# EasyEDA Pro project ProDocument_Board1_2024-07-10.epro

# Schematic 单相电能计量
Create Date: 2024-05-12; Page Name: P1; Project Name: 电赛校赛; Schematic Name: Schematic1; Update Date: 2024-07-09; Company: 无线电爱好者协会; Drawed: wuneng; Page Size: A4; Version: V1.0
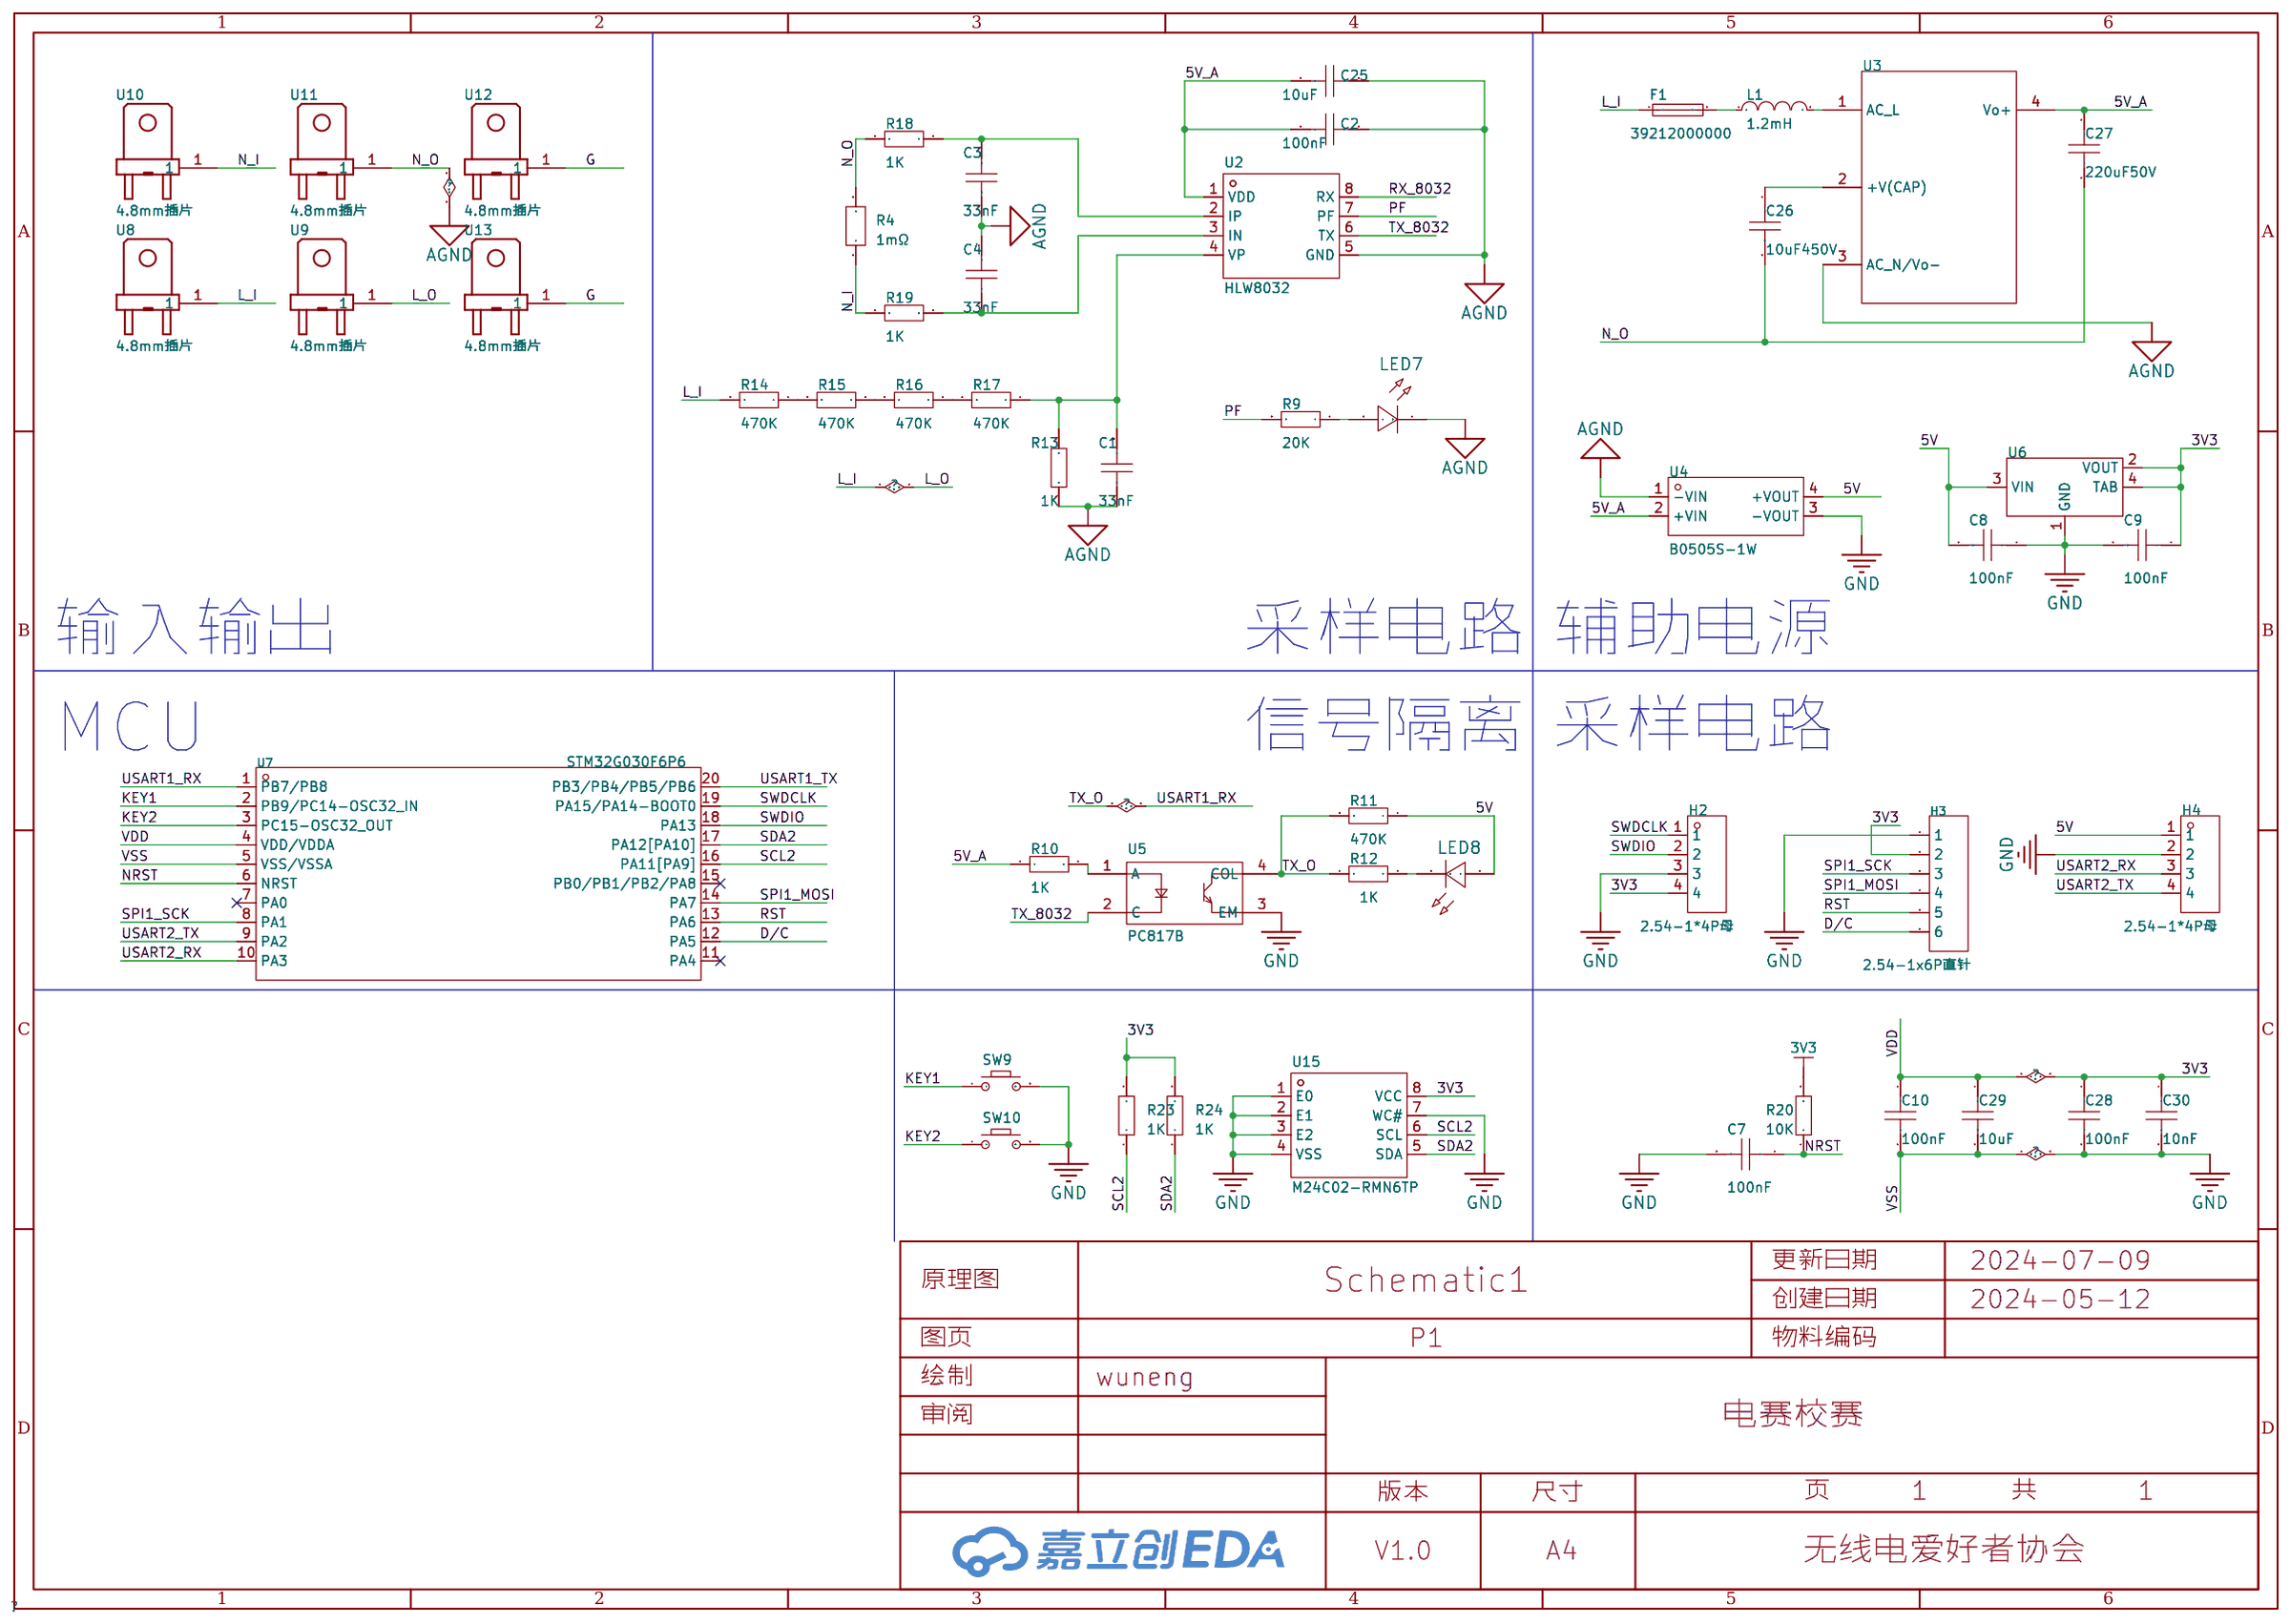
[diagram p0: schematic sheet]

## Parts
C1  33nF  [C0805]
C2  100nF  [C0805]
C3  33nF  [C0805]
C4  33nF  [C0805]
C7  100nF  [C0805]
C8  100nF  [C0805]
C9  100nF  [C0805]
C10  100nF  [C0805]
C25  10uF  [C0805]
C26  10uF450V  [CAP-TH_BD13.5-P5.00-D0.8-FD]
C27  220uF50V  [CAP-TH_BD10.0-F5.00-D0.6-FD]
C28  100nF  [C0805]
C29  10uF  [C0805]
C30  10nF  [C0805]
F1  39212000000  [FUSE-TH_L8.5-W4.0-P5.08-D0.6]
H2  2.54-1*4P母  [HDR-TH_4P-P2.54-V-F]
H3  2.54-1x6P直针  [HDR-TH_6P-P2.54-V-M-1]
H4  2.54-1*4P母  [HDR-TH_4P-P2.54-V-F]
L1  1.2mH  [IND-SMD_L5.8-W5.2]
LED7  -  [LED_0603]
LED8  -  [LED_0603]
R4  1mΩ  [RES-SMD_L6.4-W3.2-R2512]
R9  20K  [R0603]
R10  1K  [R0805]
R11  470K  [R0805]
R12  1K  [R0805]
R13  1K  [R0805]
R14  470K  [R0805]
R15  470K  [R0805]
R16  470K  [R0805]
R17  470K  [R0805]
R18  1K  [R0805]
R19  1K  [R0805]
R20  10K  [R0805]
R23  1K  [R0805]
R24  1K  [R0805]
SW9  -  [Key_TH_3.5x6x4.3]
SW10  -  [Key_TH_3.5x6x4.3]
U2  HLW8032  [SOP-8_L4.9-W3.9-P1.27-LS6.0-BL]
U3  -  [LS01-K3B05SS]
U4  B0505S-1W  [PWRM-TH_B0505S-1W]
U5  PC817B  [OPTO-SMD-4_L4.6-W6.5-P2.54-LS10.3-TL]
U6  -  [SOT_223]
U7  STM32G030F6P6  [TSSOP-20_L6.5-W4.4-P0.65-LS6.4-BL]
U8  4.8*0.8MM  [footprint_927b]
U9  4.8*0.8MM  [footprint_927b]
U10  4.8*0.8MM  [footprint_927b]
U11  4.8*0.8MM  [footprint_927b]
U12  4.8*0.8MM  [footprint_927b]
U13  4.8*0.8MM  [footprint_927b]
U15  M24C02-RMN6TP  [SOIC-8_L4.9-W3.9-P1.27-LS6.0-BL]

## Library data of the parts
C1-C4 C7-C10 C25 C28-C30 = CAP_0805: Supplier Footprint: 0805
C26 C27 = CAP_0603: Supplier Footprint: 0603
F1 = 39212000000: 类型:-;额定电流:2A;分断能力:25A;; LCSC Part Name: 插件式保险丝; Supplier Part: C142678; Manufacturer: Littelfuse(美国力特); Supplier Footprint: 插件; JLCPCB Part Class: Extended Part; Datasheet: https://atta.szlcsc.com/upload/public/pdf/source/20180403/C178817_2D458C2629887F55DF1F1D88ABF4A67F.pdf; Supplier: LCSC; Current Rating: 2A; Operating Temperature: -40℃~+125℃; Breaking Capacity: 25A
H2 H4 = 2.54-1*4P母: 插孔结构:1x4P;间距:2.54mm;行距:-;圆孔/方孔:方孔;安装类型:直插;排数:单排;总孔位数:4P;额定电流:3A;额定电压:-;插孔方向:顶部;塑高:-;触头材质:青铜;触头镀层:-;工作温度范围:-40℃~+105℃;焊接温度(最大值):-;; LCSC Part Name: 间距:2.54mm 1x4P 直插; Supplier Part: C2718488; Manufacturer: BOOMELE(博穆精密); Supplier Footprint: 插件,P=2.54mm; JLCPCB Part Class: Extended Part; Datasheet: https://atta.szlcsc.com/upload/public/pdf/source/20210301/C2718488_F4427B881E42CAA8DDB0B1C12B3A522C.pdf; Supplier: LCSC; Holes Structure: 1x4P; Pitch: 2.54mm; Circular Hole / Square Hole: 方孔; Mounting Type: 直插; Number of Rows: 单排; Number of Holes: 4P; Current Rating (Max): 3A; Holes Direction: 顶部; Contact Material: 青铜; Operating Temperature Range: -40℃~+105℃
H3 = 2.54-1x6P直针: 插针结构:1x6P;间距:2.54mm;行距:-;圆针/方针:方针;安装类型:直插;排数:单排;总PIN位数:6P;额定电流:3A;额定电压:-;配合针长度:-;塑高:-;触头材质:黄铜;触头镀层:-;工作温度范围:-40℃~+105℃;颜色:黑色;; LCSC Part Name: 间距:2.54mm 1x6P 直插 方针; Supplier Part: C37208; Manufacturer: BOOMELE(博穆精密); Supplier Footprint: 插件,P=2.54mm; JLCPCB Part Class: Extended Part; Supplier: LCSC; Pin Structure: 1x6P; Pitch: 2.54mm; Circluar Pins/Square Pins: 方针; Mounting Type: 直插; Number of Rows: 单排; Number of Pins: 6P; Current Rating (Max): 3A; Contact Material: 黄铜; Operating Temperature Range: -40℃~+105℃; Color: 黑色
L1 = CD54-1R0M: 电感值:1uH;精度:±20%;额定电流:5.9A;; LCSC Part Name: 1uH ±20%; Supplier Part: C501729; Manufacturer: Me-TECH(美台高科); Supplier Footprint: SMD; JLCPCB Part Class: Extended Part; Datasheet: https://atta.szlcsc.com/upload/public/pdf/source/20200324/C501728_0ED92A661C9AA91DB0CB8AF3A2A8117A.pdf; Supplier: LCSC; Tolerance: ±20%; Rated Current: 5.9A; DC Resistance (DCR): 15mΩ
LED7 LED8 = LED_0603-R: Supplier Footprint: 0603
R4 = HoJLR2512-3W-1mR-1%: 电阻类型:采样电阻;阻值:1mΩ;精度:±1%;功率:3W;安装方式:贴片;; LCSC Part Name: 1mΩ ±1% 3W; Supplier Part: C2903470; Manufacturer: Milliohm(毫欧); Supplier Footprint: 2512; JLCPCB Part Class: Extended Part; Datasheet: https://atta.szlcsc.com/upload/public/pdf/source/20211009/7525CABAB363C979E942C1DD41F1FEF0.pdf; Supplier: LCSC; Type: 采样电阻; Tolerance: ±1%; Power(Watts): 3W; Mounting Sytle: 贴片
R9 = Res_0603: Supplier Footprint: 0603
R10-R20 R23 R24 = Res_0805: Supplier Footprint: 0805
SW9 SW10 = Key_TH_3.5x6x4.3: Supplier Footprint: 插件
U2 = HLW8032: HLW8012的升级版串口输出所有数据; Supplier Part: C128023; Manufacturer: 合力为; Supplier Footprint: SOP-8; JLCPCB Part Class: Extended Part; Datasheet: https://atta.szlcsc.com/upload/public/pdf/source/20230727/AC46BB344F63DE89EDC3EE31E404726D.pdf; Supplier: LCSC
U3 = LS01-K3B05SS
U4 = B0505S-1W_C7465127: 转换类型:DC-DC;输入电压(DC):4.5V~5.5V;输出电压:5V;输出功率:1W;输出电流(最大值):200mA;转换效率:80%;; LCSC Part Name: DC-DC输入5V输出5V200mA 1W; Supplier Part: C7465127; Manufacturer: EVISUN(易成); Supplier Footprint: SIP-4; JLCPCB Part Class: Extended Part; Datasheet: https://atta.szlcsc.com/upload/public/pdf/source/20230718/F78F189F7326C257ACEB9375A76D3582.pdf; Supplier: LCSC; Conversion Type: DC-DC; Input Voltage(DC): 4.5V~5.5V; Output Voltage: 5V; Output Power: 1W; Output Current (Max): 200mA; Isolation or not: 隔离; Output Channel: 1; Insulated Voltage: 1.5kV; Conversion Efficiency: 80%; Maximum Capacitive Load: 100uF
U5 = PC817B_C3025163: 输入电压类型:DC;正向电压:1.2V;输出电流:50mA;隔离电压(rms):5kV;反向电压:6V;接收端电压:35V;输出通道数:1;集射极饱和电压(Vce(sat)@Ic,IF):100mV@1mA,20mA;; LCSC Part Name: B档; Supplier Part: C3025163; Manufacturer: GOODWORK(固得沃克); Supplier Footprint: SMD-4P; JLCPCB Part Class: Extended Part; Datasheet: https://atta.szlcsc.com/upload/public/pdf/source/20220530/3FD5D572B823BA05C967330A07ECF74F.pdf; Supplier: LCSC; Input voltage type: DC; Output Type: 光电三极管; Forward Voltage: 1.2V; Output Current: 50mA; Isolation Voltage(rms): 5kV; Reverse Voltage: 6V; Receiving End Voltage: 35V; Number of Outputs: 1; Collector-Emitter Saturation Voltage (Vce(sat)@Ic,IF): 100mV@1mA,20mA; Rise time: 6us@2mA,100Ω; Fall time: 5us@2mA,100Ω; Operating Temperature: -55℃~+110℃
U6 = AMS1117
U7 = STM32G030F6P6: CPU内核:ARM Cortex-M0;CPU最大主频:64MHz;工作电压范围:2V~3.6V;程序存储容量:32KB;程序存储器类型:FLASH;RAM总容量:8KB;GPIO端口数量:18;; Supplier Part: C724040; Manufacturer: ST(意法半导体); Supplier Footprint: TSSOP-20; JLCPCB Part Class: Extended Part; Datasheet: https://atta.szlcsc.com/upload/public/pdf/source/20200511/C529329_A1CB615556C746C4EA827FCAD1461480.pdf; Supplier: LCSC; CPU Core: ARM Cortex-M0; Program Storage Size: 32KB; RAM Size: 8KB; GPIO Ports Number: 18; Operating Voltage Range: 2V~3.6V; CPU Maximum Speed: 64MHz; Program Memory Type: FLASH; Operating Temperature Range: -40℃~+85℃; ADC (Bit): 12bit; Peripheral/Function: DMA；看门狗；看门狗; Internal Oscillator: 有
U8-U13 = 插片*定位*环保  4.8*0.8MM: Part Code: CP0000000005
U15 = M24C02-RMN6TP: 接口类型:I2C;存储容量:2Kbit;; Supplier Part: C83836; Manufacturer: ST(意法半导体); Supplier Footprint: SOIC-8; JLCPCB Part Class: Extended Part; Datasheet: https://atta.szlcsc.com/upload/public/pdf/source/20170713/C118273_1499918870536816701.pdf; Supplier: LCSC; Interface Type: I2C; Memory Size: 2Kbit; Supply Voltage: 1.8V~5.5V; Operating Temperature: -40℃~+85℃

## Nets
3V3: C9.1 C10.1 C28.1 C29.1 C30.1 H2.4 H3.2 R20.2 R23.2 R24.2 U6.2(VOUT) U6.4(TAB) U7.4(VDD/VDDA) U15.8(VCC)
5V: C8.2 H4.1 LED8.2(A) R11.1 U4.4(+VOUT) U6.3(VIN)
5V_A: C2.2 C25.2 C27.1 R10.1 U2.1(VDD) U3.4(Vo+) U4.2(+VIN)
AGND: C1.1 C2.1 C3.1 C4.2 C25.1 C26.2 C27.2 LED7.1(C) R4.2 R13.1 R18.1 U2.5(GND) U3.3(AC_N/Vo-) U4.1(-VIN) U11.1
GND: C7.2 C8.1 C9.2 C10.2 C28.2 C29.2 C30.2 H2.3 H3.1 H4.2 SW9.B SW10.B U4.3(-VOUT) U5.3(EM) U6.1(GND) U7.5(VSS/VSSA) U15.1(E0) U15.2(E1) U15.3(E2) U15.4(VSS) U15.7(WC#)
D/C: H3.6 U7.12(PA5)
G: U12.1 U13.1
KEY1: SW9.A U7.2(PB9/PC14-OSC32_IN)
KEY2: SW10.A U7.3(PC15-OSC32_OUT)
L_I: F1.1 R14.2 U8.1 U9.1
N_I: R4.1 R19.1 U10.1
NRST: C7.1 R20.1 U7.6(NRST)
PF: R9.2 U2.7(PF)
RST: H3.5 U7.13(PA6)
RX_8032: U2.8(RX)
SCL2: R23.1 U7.16(PA11[PA9]) U15.6(SCL)
SDA2: R24.1 U7.17(PA12[PA10]) U15.5(SDA)
SPI1_MOSI: H3.4 U7.14(PA7)
SPI1_SCK: H3.3 U7.8(PA1)
SWDCLK: H2.1 U7.19(PA15/PA14-BOOT0)
SWDIO: H2.2 U7.18(PA13)
TX_8032: U2.6(TX) U5.2(C)
TX_O: R11.2 R12.1 U5.4(COL) U7.1(PB7/PB8)
USART1_TX: U7.20(PB3/PB4/PB5/PB6)
USART2_RX: H4.3 U7.10(PA3)
USART2_TX: H4.4 U7.9(PA2)
$1N1407: R10.2 U5.1(A)
$1N1931: R14.1 R15.2
$1N1957: R15.1 R16.2
$1N1983: R16.1 R17.2
$1N2054: C1.2 R13.2 R17.1 U2.4(VP)
$1N2295: C4.1 R19.2 U2.3(IN)
$1N2301: C3.2 R18.2 U2.2(IP)
$1N3303: LED7.2(A) R9.1
$1N4096: C26.1 U3.2(+V(CAP))
$1N4245: L1.2 U3.1(AC_L)
$1N4248: F1.2 L1.1
$1N6696: LED8.1(C) R12.2

Not connected (* = marked no-connect by the designer): U7 7(PA0)* 11(PA4)* 15(PB0/PB1/PB2/PA8)*

## Notes on the sheet
- 输入输出
- 采样电路
- 辅助电源
- MCU
- 信号隔离
- 采样电路

# Board 单项电能计量
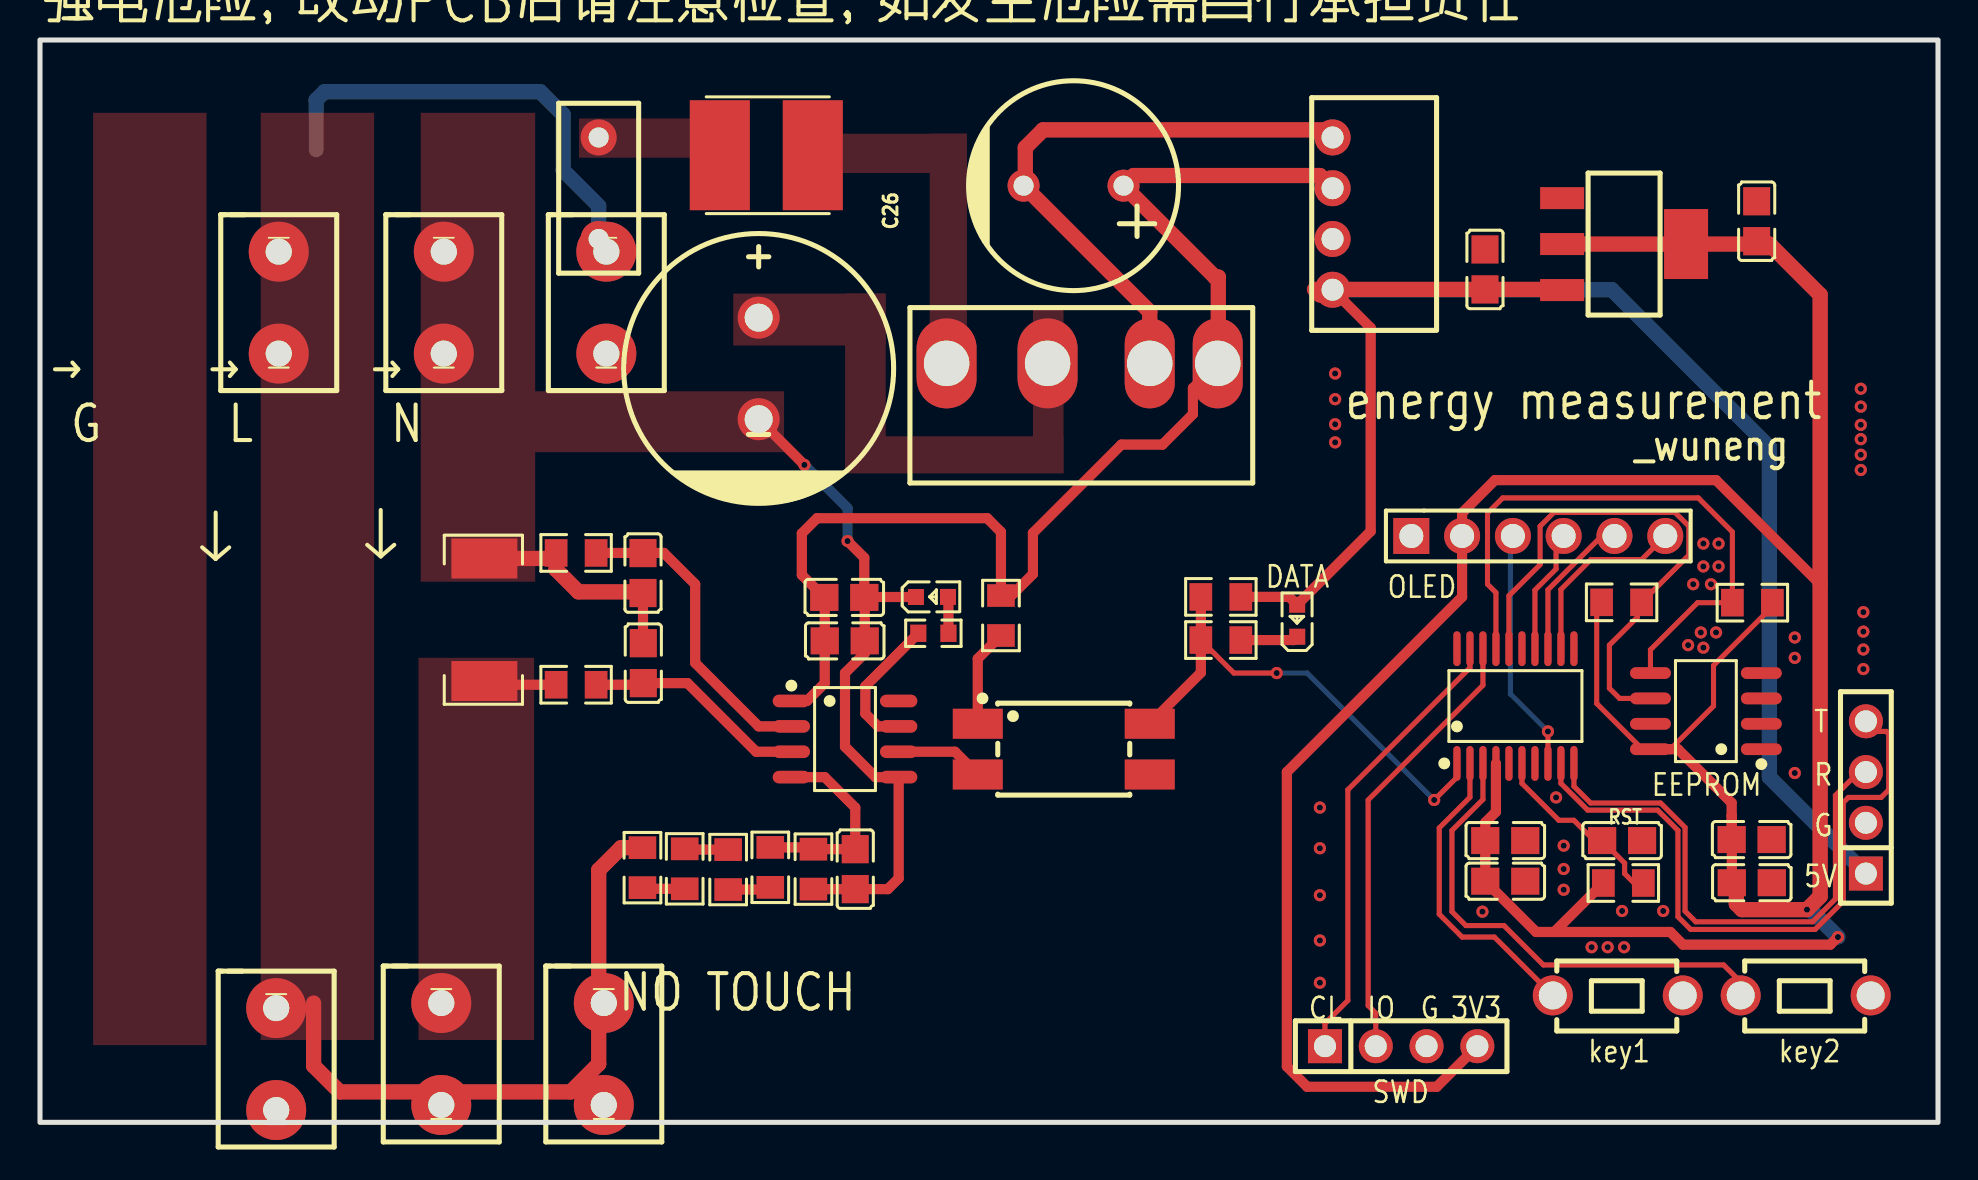
[diagram p1: board, top side]
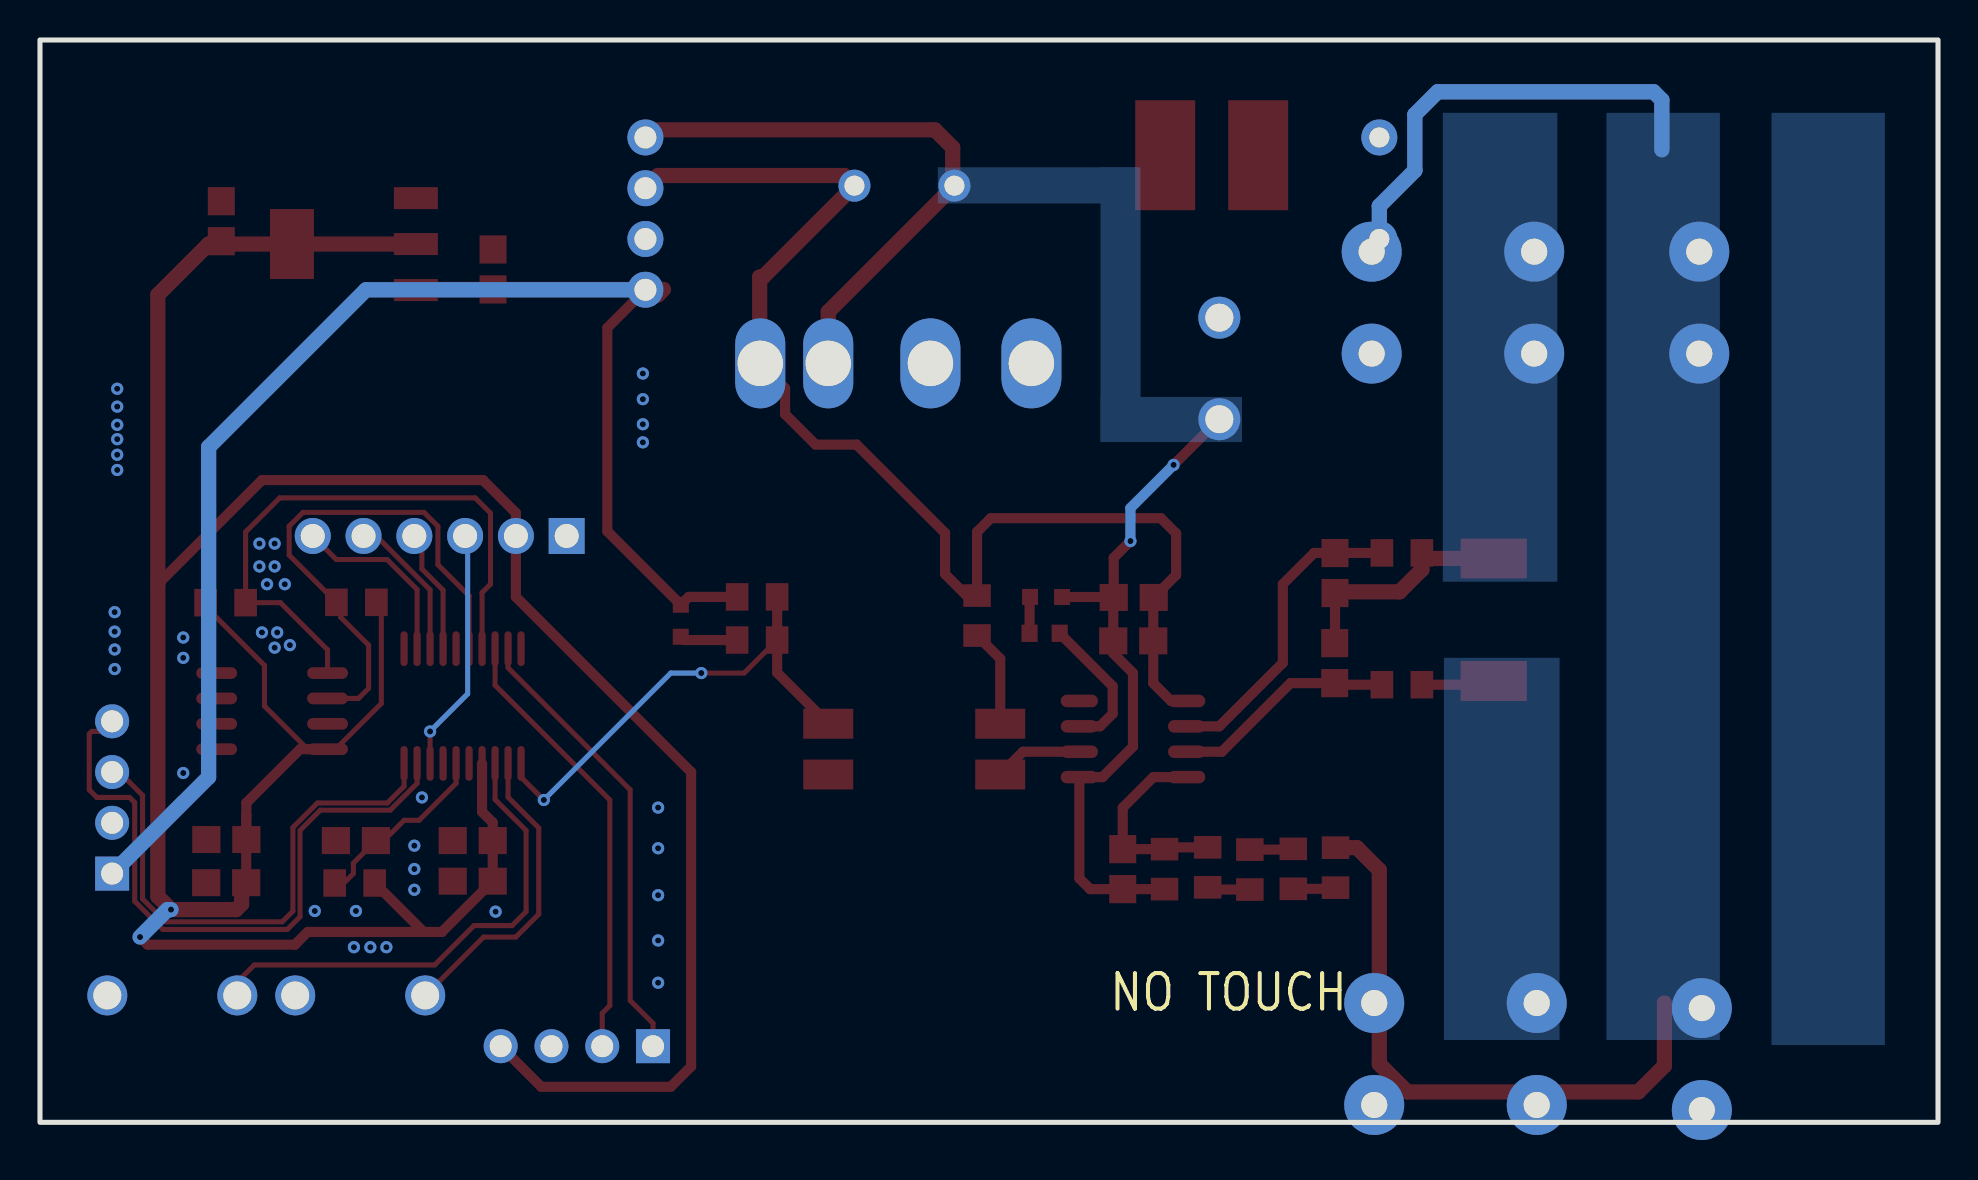
[diagram p2: board, bottom side, seen from below]

Outline 94.92 x 54.15 mm; copper layers: Top Layer, Bottom Layer. Coordinates in mm from the lower left corner of the outline.
Outline path: rectangle 0,54.15 94.92,0
Stack: Top Layer 0.035mm / Dielectric1 1.51mm FR4 er 4.5 / Bottom Layer 0.035mm

## Design rules (mm)
template: JLCPCB Capability(Two Layers Board)
spacing copperThickness1oz (default): track to track 0.102, other pairs 0.152 to 0.3
spacing copperThickness2oz: track to track 0.203, other pairs 0.152 to 0.3
track width copperThickness1oz (default): min 0.127, default 0.254, max 2.54
track width copperThickness2oz: min 0.203, default 0.254, max 2.54
differential pair differentialPair (default): width min 0.127, default 0.254, max 2.54; gap min 0.152, default 0.152
via viaSize (default): diameter min 0.5, default 0.61, max 10; hole min 0.3, default 0.305, max 6.3

## Placement (name value [footprint] x y rotation side)
C1  33nF  [C0805]  40.77 12.67 90 top
C2  100nF  [C0805]  40.22 26.26 180 top
C3  33nF  [C0805]  30.16 27.48 90 top
C4  33nF  [C0805]  30.17 22.97 90 top
C7  100nF  [C0805]  79.12 14.1 0 top
C8  100nF  [C0805]  72.26 42.67 270 top
C9  100nF  [C0805]  85.85 45.08 90 top
C10  100nF  [C0805]  73.28 12.06 0 top
C25  10uF  [C0805]  40.25 24.09 180 top
C26  10uF450V  [CAP-TH_BD13.5-P5.00-D0.8-FD]  35.94 37.72 270 top
C27  220uF50V  [CAP-TH_BD10.0-F5.00-D0.6-FD]  51.69 46.86 180 top
C28  100nF  [C0805]  85.6 14.15 0 top
C29  10uF  [C0805]  73.28 14.1 0 top
C30  10nF  [C0805]  85.61 11.99 0 top
F1  39212000000  [FUSE-TH_L8.5-W4.0-P5.08-D0.6]  27.94 46.74 90 top
H2  2.54-1*4P母  [HDR-TH_4P-P2.54-V-F]  68.07 3.81 0 top
H3  2.54-1x6P直针  [HDR-TH_6P-P2.54-V-M-1]  74.93 29.34 0 top
H4  2.54-1*4P母  [HDR-TH_4P-P2.54-V-F]  91.31 16.26 90 top
L1  1.2mH  [IND-SMD_L5.8-W5.2]  36.32 48.39 180 top
LED7  -  [LED_0603]  44.66 26.29 0 top
LED8  -  [LED_0603]  62.86 25.15 90 top
R4  1mΩ  [RES-SMD_L6.4-W3.2-R2512]  22.22 25.15 90 top
R9  20K  [R0603]  44.68 24.47 180 top
R10  1K  [R0805]  48.06 25.36 270 top
R11  470K  [R0805]  59.05 26.29 180 top
R12  1K  [R0805]  59.05 24.13 0 top
R13  1K  [R0805]  38.68 12.67 90 top
R14  470K  [R0805]  30.13 12.74 90 top
R15  470K  [R0805]  32.24 12.68 270 top
R16  470K  [R0805]  34.41 12.65 90 top
R17  470K  [R0805]  36.52 12.76 270 top
R18  1K  [R0805]  26.81 28.49 0 top
R19  1K  [R0805]  26.81 21.89 0 top
R20  10K  [R0805]  79.18 11.97 180 top
R23  1K  [R0805]  79.1 26.02 180 top
R24  1K  [R0805]  85.64 26 0 top
SW9  -  [Key_TH_3.5x6x4.3]  78.74 6.35 0 top
SW10  -  [Key_TH_3.5x6x4.3]  88.14 6.35 0 top
U2  HLW8032  [SOP-8_L4.9-W3.9-P1.27-LS6.0-BL]  40.26 19.18 270 top
U3  -  [LS01-K3B05SS]  45.34 37.97 0 top
U4  B0505S-1W  [PWRM-TH_B0505S-1W]  64.64 45.47 270 top
U5  PC817B  [OPTO-SMD-4_L4.6-W6.5-P2.54-LS10.3-TL]  51.2 18.67 0 top
U6  -  [SOT_223]  79.25 43.94 270 top
U7  STM32G030F6P6  [TSSOP-20_L6.5-W4.4-P0.65-LS6.4-BL]  73.79 20.83 0 top
U8  4.8*0.8MM  [footprint_927b]  10.54 3.94 0 top
U9  4.8*0.8MM  [footprint_927b]  10.67 41.53 0 top
U10  4.8*0.8MM  [footprint_927b]  18.67 3.94 0 top
U11  4.8*0.8MM  [footprint_927b]  18.8 41.53 0 top
U12  4.8*0.8MM  [footprint_927b]  2.29 3.68 0 top
U13  4.8*0.8MM  [footprint_927b]  2.41 41.53 0 top
U15  M24C02-RMN6TP  [SOIC-8_L4.9-W3.9-P1.27-LS6.0-BL]  83.31 20.57 90 top

## Footprints (pads in the part's own frame, mm; a bottom-side part is the same pattern mirrored in y, then rotated)
C0805
  rect 1.41x1.35 smd: 1(-1,0) 2(1,0)
CAP-TH_BD10.0-F5.00-D0.6-FD
  round 1.6 hole 1: 1(-2.5,0) 2(2.5,0)
CAP-TH_BD13.5-P5.00-D0.8-FD
  round 2.1 hole 1.4: 1(-2.54,0) 2(2.54,0)
footprint_927b
  round 3 hole 1.305x1.3: 20(9.527,-3.067) 21(9.527,2.033)
FUSE-TH_L8.5-W4.0-P5.08-D0.6
  round 1.8 hole 1: 1(-2.54,0) 2(2.54,0)
HDR-TH_4P-P2.54-V-F
  rect 1.7x1.7 hole 1.1: 1(-3.81,0)
  round 1.7 hole 1.1: 2(-1.27,0) 3(1.27,0) 4(3.81,0)
HDR-TH_6P-P2.54-V-M-1
  rect 1.8x1.8 hole 1.2: 1(-6.35,0)
  round 1.8 hole 1.2: 2(-3.81,0) 3(-1.27,0) 4(1.27,0) 5(3.81,0) 6(6.35,0)
IND-SMD_L5.8-W5.2
  rect 3x5.5 smd: 1(2.325,0) 2(-2.325,0)
Key_TH_3.5x6x4.3
  round 1.999 hole 1.399: A(-3.084,0) B(3.416,0)
LED_0603
  rect 0.8x0.8 smd: 1(-0.851,-0.01) 2(0.75,-0.005)
LS01-K3B05SS
  oval 3x4.5 hole 2.27: 1(0,0) 2(5.05,0)
  oval 2.5x4.5 hole 2.27: 3(10.16,0) 4(13.56,0)
OPTO-SMD-4_L4.6-W6.5-P2.54-LS10.3-TL
  rect 2.5x1.5 smd: 1(-4.3,1.27) 2(-4.3,-1.27) 3(4.3,-1.27) 4(4.3,1.27)
PWRM-TH_B0505S-1W
  round 1.8 hole 1.1: 1(-3.81,0) 2(-1.27,0) 3(1.27,0) 4(3.81,0)
R0603
  rect 0.806x0.864 smd: 1(-0.753,0) 2(0.753,0)
R0805
  rect 1.133x1.377 smd: 1(-1,0) 2(1,0)
RES-SMD_L6.4-W3.2-R2512
  rect 2x3.3 smd: 1(-3.067,0) 2(3.067,0)
SOIC-8_L4.9-W3.9-P1.27-LS6.0-BL
  oval 0.588x2.045 smd: 1(-1.905,-2.772) 2(-0.635,-2.772) 3(0.635,-2.772) 4(1.905,-2.772) 5(1.905,2.772) 6(0.635,2.772) 7(-0.635,2.772) 8(-1.905,2.772)
SOP-8_L4.9-W3.9-P1.27-LS6.0-BL
  oval 0.63x1.865 smd: 1(-1.905,-2.683) 2(-0.635,-2.683) 3(0.635,-2.683) 4(1.905,-2.683) 5(1.905,2.683) 6(0.635,2.683) 7(-0.635,2.683) 8(-1.905,2.683)
SOT_223
  rect 1.1x2.2 smd: 1(-2.299,-3.126) 2(0,-3.126) 3(2.301,-3.126)
  rect 3.5x2.2 smd: 4(0,3.072)
TSSOP-20_L6.5-W4.4-P0.65-LS6.4-BL
  oval 0.364x1.742 smd: 1(-2.925,-2.871) 2(-2.275,-2.871) 3(-1.625,-2.871) 4(-0.975,-2.871) 5(-0.325,-2.871) 6(0.325,-2.871) 7(0.975,-2.871) 8(1.625,-2.871) 9(2.275,-2.871) 10(2.925,-2.871) 11(2.925,2.871) 12(2.275,2.871) 13(1.625,2.871) 14(0.975,2.871) 15(0.325,2.871) 16(-0.325,2.871) 17(-0.975,2.871) 18(-1.625,2.871) 19(-2.275,2.871) 20(-2.925,2.871)

## Nets
As in the schematic, except:
AGND: C1.1 C2.1 C3.1 C4.2 C25.1 C26.2 C27.2 LED7.1 R4.2 R13.1 R18.1 U2.5 U3.3 U4.1
L_I: F1.1 R14.2
N_I: R4.1 R19.1

Pads without a net: U7 7 11 15; U8 20 21; U9 20 21; U10 20 21; U11 20 21; U12 20 21; U13 20 21

## Via types
v1: diameter 0.61, hole 0.305, Top Layer to Bottom Layer, 49 vias

## Routing (per net, layer and track width the routed paths; a pad name or vN(x,y) marks a point on that pad's centre or on a via; arc(x,y) is an arc through that point)
3V3: length 172.1
  Top Layer w0.254: R24.2 86.64,25.8 83.69,22.86 83.69,20.83 81.53,18.67 ; U15.8 80.14,18.67 77.85,20.95 77.85,25.77 R23.2
  Top Layer w0.508: 84.6,15.35 84.61,15.35 C30.1 ; 84.6,15.35 C28.1 ; 84.6,15.35 84.6,15.98 81.92,18.67 U15.8 ; R20.2 75.73,9.52 ; 75.73,9.52 81.53,9.52 82.17,8.89 89.54,8.89 v1(89.92,9.27) ; 75.73,9.52 74.82,9.52 C10.1 C29.1 72.28,15 72.81,15.53 U7.4 ; 89.03,26.92 83.82,32.13 72.76,32.13 71.12,30.49 H3.2 71.12,26.29 62.36,17.53 62.36,2.79 63.37,1.78 69.85,1.78 H2.4
  Top Layer w0.762: C30.1 84.84,11.76 84.84,10.92 85.11,10.64 v1(88.37,10.64) 89.03,11.3 89.03,41.4 86.49,43.94 U6.4 U6.2
  Bottom Layer w0.762: v1(88.37,10.64) 88.54,10.64 v1(89.92,9.27)
5V: length 82.1
  Top Layer w0.508: U4.4 66.55,39.75 66.55,29.57 LED8.2 62.48,26.29 R11.1
  Top Layer w0.762: 64.63,41.67 64.36,41.4 64.01,41.4 63.74,41.67 ; 64.63,41.67 U4.4 ; 64.63,41.67 C8.2 76.09,41.67 U6.3
  Bottom Layer w0.762: U4.4 78.61,41.66 86.49,33.78 86.49,17.27 H4.1
5V_A: length 63.3
  Top Layer w0.508: U2.1 38.35,21.08 39.25,21.97 C25.2 39.25,26.24 C2.2 38.1,27.39 38.1,29.46 38.86,30.23 47.37,30.23 48.06,29.54 R10.1 48.58,26.36 49.66,27.43 49.66,29.48 54.08,33.91 56.13,33.91 57.66,35.43 57.66,36.73 U3.4
  Top Layer w0.762: U3.4 58.93,38 58.93,42.29 58.76,42.29 C27.1 54.7,47.37 64.01,47.37 U4.2
AGND: length 76.3
  Top Layer w0.508: C4.2 30.16,23.99 C3.1 ; 35.94,35.18 v1(38.23,32.89) ; 41.25,26.24 C25.1 41.25,23.47 40.26,22.48 40.26,18.8 41.78,17.27 U2.5 42.94,12.21 42.4,11.67 C1.1 R13.1 ; 41.25,26.24 41.29,26.28 LED7.1 ; 41.25,26.24 C2.1 41.22,28.25 v1(40.39,29.08)
  Top Layer w0.762: R4.2 25.53,28.21 R18.1 25.81,27.66 26.92,26.54 30.09,26.54 C3.1 ; U4.1 64.77,49.4 64.77,49.66 ; C27.2 49.28,46.78 ; 49.28,46.78 55.5,40.55 U3.3 ; 49.28,46.78 49.28,48.77 50.17,49.66 64.77,49.66 ; 64.77,49.66 64.64,49.53
  Bottom Layer w0.508: v1(40.39,29.08) 40.39,30.73 v1(38.23,32.89)
GND:
  vias: v1(64.01,15.75) v1(64.01,13.71) v1(64.01,11.36) v1(64.01,9.1) v1(64.01,6.98) v1(64.77,37.46) v1(64.77,36.18) v1(64.77,34.93) v1(64.77,34.02) v1(72.14,10.54) v1(75.82,16.26) v1(76.2,13.84) v1(76.2,12.67) v1(76.2,11.64) v1(77.6,8.76) v1(78.4,8.76) v1(79.12,10.57) v1(79.22,8.76) v1(81.18,10.57) v1(82.42,23.88) v1(82.68,26.92) v1(83.06,24.51) v1(83.18,28.96) v1(83.18,27.81) v1(83.18,23.75) v1(83.57,26.92) v1(83.82,24.51) v1(83.95,28.96) v1(83.95,27.81) v1(87.76,24.26) v1(87.76,23.24) v1(87.76,17.48) v1(91.06,36.7) v1(91.06,35.81) v1(91.06,34.9) v1(91.06,34.18) v1(91.06,33.4) v1(91.06,32.64) v1(91.19,25.53) v1(91.19,24.55) v1(91.19,23.66) v1(91.19,22.68)
D/C: length 9.3
  Top Layer w0.254: 76.06,23.7 76.06,26.66 77.56,28.16 80.1,28.16 H3.6
KEY1: length 15.5
  Top Layer w0.254: U7.2 71.51,16.27 69.98,14.73 69.98,10.41 71.12,9.27 72.73,9.27 SW9.A
KEY2: length 24.6
  Top Layer w0.254: SW10.A 85.05,7.02 84.2,7.87 75.18,7.87 73.21,9.85 71.31,9.85 70.61,10.54 70.61,14.6 72.16,16.16 U7.3
L_I: length 53.3
  Top Layer w0.762: R14.2 29.06,13.74 27.94,12.62 27.94,2.92 26.54,1.52 14.99,1.52 13.68,2.83 13.68,5.97
  Bottom Layer w0.762: 13.81,48.66 13.81,51.15 14.22,51.56 25.02,51.56 26.16,50.42 26.16,47.62 27.94,45.85 F1.1
N_I: length 3.7
  Top Layer w0.508: R4.1 22.41,21.89 R19.1
NRST: length 9.4
  Top Layer w0.254: R20.1 79.72,11.97 79.25,12.45 79.25,12.97 C7.1 77.72,14.1 76.71,15.11 75.96,15.11 74.11,16.96 U7.6
PF: length 7
  Top Layer w0.508: 43.92,24.47 41.27,21.82 41.27,20.45 41.91,19.81 U2.7
RST: length 7.4
  Top Layer w0.254: H3.5 78.11,29.34 75.41,26.64 75.41,23.7
SCL2: length 26.8
  Top Layer w0.254: 80.54,21.21 78.99,21.21 78.49,21.72 78.49,23.88 79.88,25.27 79.88,25.8 R23.1 82.46,28.38 82.46,29.83 81.77,30.52 75.71,30.52 75.02,29.83 75.02,27.9 73.46,26.34 73.46,23.7
SDA2: length 30
  Top Layer w0.254: U15.5 80.54,23.64 82.9,26 R24.1 84.64,29.54 82.93,31.24 73.15,31.24 72.39,30.48 72.39,26.92 72.81,26.5 72.81,23.7
SPI1_MOSI: length 6.2
  Top Layer w0.254: H3.4 75.82,28.96 75.82,27.69 74.76,26.63 74.76,23.7
SPI1_SCK: length 12.2
  Top Layer w0.254: U7.8 v1(75.41,19.56)
  Bottom Layer w0.254: v1(75.41,19.56) 73.53,21.44 73.53,29.21 H3.3
SWDCLK: length 22.9
  Top Layer w0.254: 71.51,23.7 71.51,22.74 65.4,16.64 65.4,6.1 64.26,4.95 H2.1
SWDIO: length 22.4
  Top Layer w0.254: H2.2 66.8,5.46 66.42,5.84 66.42,16.13 72.16,21.87 72.16,23.7
TX_8032: length 4.4
  Top Layer w0.508: U2.6 45.76,18.54 U5.2
TX_O: length 24.7
  Top Layer w0.254: R12.1 59.71,22.48 v1(61.85,22.48) ; v1(69.72,16.13) 70.86,17.27 U7.1
  Top Layer w0.508: R11.2 R12.1 58.05,24.04 57.98,23.97 57.98,23.94 58.05,23.86 58.05,22.5 U5.4
  Bottom Layer w0.254: v1(69.72,16.13) 63.37,22.48 v1(61.85,22.48)
USART2_RX: length 27.1
  Top Layer w0.254: U7.10 76.71,16.81 77.55,15.98 81.05,15.98 82.27,14.75 82.27,10.57 82.8,10.03 88.65,10.03 89.79,11.18 89.79,16.36 90.95,17.53 H4.3
USART2_TX: length 32.9
  Top Layer w0.254: U7.9 76.06,16.96 77.4,15.62 80.9,15.62 81.92,14.6 81.92,10.29 82.55,9.65 88.77,9.65 90.18,11.06 90.18,16 90.44,16.26 92.08,16.26 92.46,16.64 92.46,19.43 92.33,19.56 91.82,19.56 H4.4
$1N1407: length 4.9
  Top Layer w0.508: R10.2 46.9,23.2 U5.1
$1N1931: length 2.1
  Top Layer w0.508: R14.1 30.19,11.68 R15.2
$1N1957: length 2.2
  Top Layer w0.508: R15.1 32.28,13.65 R16.2
$1N1983: length 2.2
  Top Layer w0.508: R16.1 36.41,11.65 R17.2
$1N2054: length 10.2
  Top Layer w0.508: R17.1 38.59,13.76 R13.2 C1.2 40.77,15.74 39.24,17.27 U2.4
$1N2295: length 11.2
  Top Layer w0.508: U2.3 35.81,18.54 32.38,21.97 C4.1 30.09,21.89 R19.2
$1N2301: length 15.7
  Top Layer w0.508: R18.2 30.15,28.49 ; 30.15,28.49 31.2,28.49 32.77,26.92 32.77,22.99 35.94,19.81 U2.2 ; 30.15,28.49 C3.2
$1N3303: length 1.8
  Top Layer w0.508: 45.41,26.29 45.43,26.26 R9.1
$1N6696: length 2.9
  Top Layer w0.508: R12.2 62.71,24.13 LED8.1

## Copper pours and planes (outline as drawn; the poured copper is in the pictures)
AGND on Top Layer: 19.04,50.51 24.77,50.51 24.77,27.05 19.04,27.05
AGND on Top Layer: 23.62,36.58 37.21,36.58 37.21,33.53 23.62,33.53
AGND on Bottom Layer: 40.01,47.78 50.02,47.78 50.02,45.97 40.01,45.97
AGND on Bottom Layer: 39.88,47.78 41.88,47.78 41.88,34.04 39.88,34.04
AGND on Bottom Layer: 19.04,50.51 24.77,50.51 24.77,27.05 19.04,27.05
AGND on Bottom Layer: 34.81,36.29 41.88,36.29 41.88,34.04 34.81,34.04
GND on Top Layer: 69.79,62.03 95.68,62.03 95.68,45.27 69.79,45.27
GND on Top Layer: 52.32,30.23 95.12,30.23 95.12,-0.38 52.32,-0.38
GND on Top Layer: 62.84,45.58 96.19,45.58 96.19,26.1 62.84,26.1
GND on Bottom Layer: 70.42,54.84 94.87,54.84 94.87,29.55 70.42,29.55
GND on Bottom Layer: 63.6,45.44 95.38,45.44 95.38,28.57 63.6,28.57
GND on Bottom Layer: 52.32,30.23 94.87,30.23 94.87,0.25 52.32,0.25
(no net) on Top Layer: 2.66,50.51 8.33,50.51 8.33,3.86 2.66,3.86
(no net) on Bottom Layer: 2.66,50.51 8.33,50.51 8.33,3.86 2.66,3.86
L_I on Top Layer: 11.04,50.51 16.71,50.51 16.71,4.12 11.04,4.12
L_I on Bottom Layer: 10.91,50.51 16.58,50.51 16.58,4.12 10.91,4.12
N_I on Top Layer: 18.92,23.24 24.71,23.24 24.71,4.12 18.92,4.12
N_I on Bottom Layer: 18.92,23.24 24.71,23.24 24.71,4.12 18.92,4.12
$1N4096 on Top Layer: 40.27,34.33 51.19,34.33 51.19,32.47 40.27,32.47
$1N4096 on Top Layer: 49.66,40.76 51.19,40.76 51.19,32.51 49.66,32.51
$1N4096 on Top Layer: 40.27,41.46 42.29,41.46 42.29,32.51 40.27,32.51
$1N4096 on Top Layer: 34.67,41.46 42.29,41.46 42.29,38.86 34.67,38.86
$1N4245 on Top Layer: 38.34,49.46 46.36,49.46 46.36,47.5 38.34,47.5
$1N4245 on Top Layer: 44.49,49.46 46.36,49.46 46.36,39.12 44.49,39.12
$1N4248 on Top Layer: 26.96,50.22 33.02,50.22 33.02,48.26 26.96,48.26

## Text on the board
Bottom Silkscreen Layer: NO TOUCH
Top Silkscreen Layer: RST | DATA | CL | IO | SWD | OLED | G | 3V3 | key1 | EEPROM | key2 | 5V | T | R | _wuneng | NO TOUCH | energy measurement | → / G | → / L | → / N | DRC可忽略，属于元件设计问题 / 强电危险，改动PCB后请注意检查，如发生危险需自行承担责任 | →
